# Altium schematic sheet nanoDAP-mini.SchDoc
size 340 x 398 mm
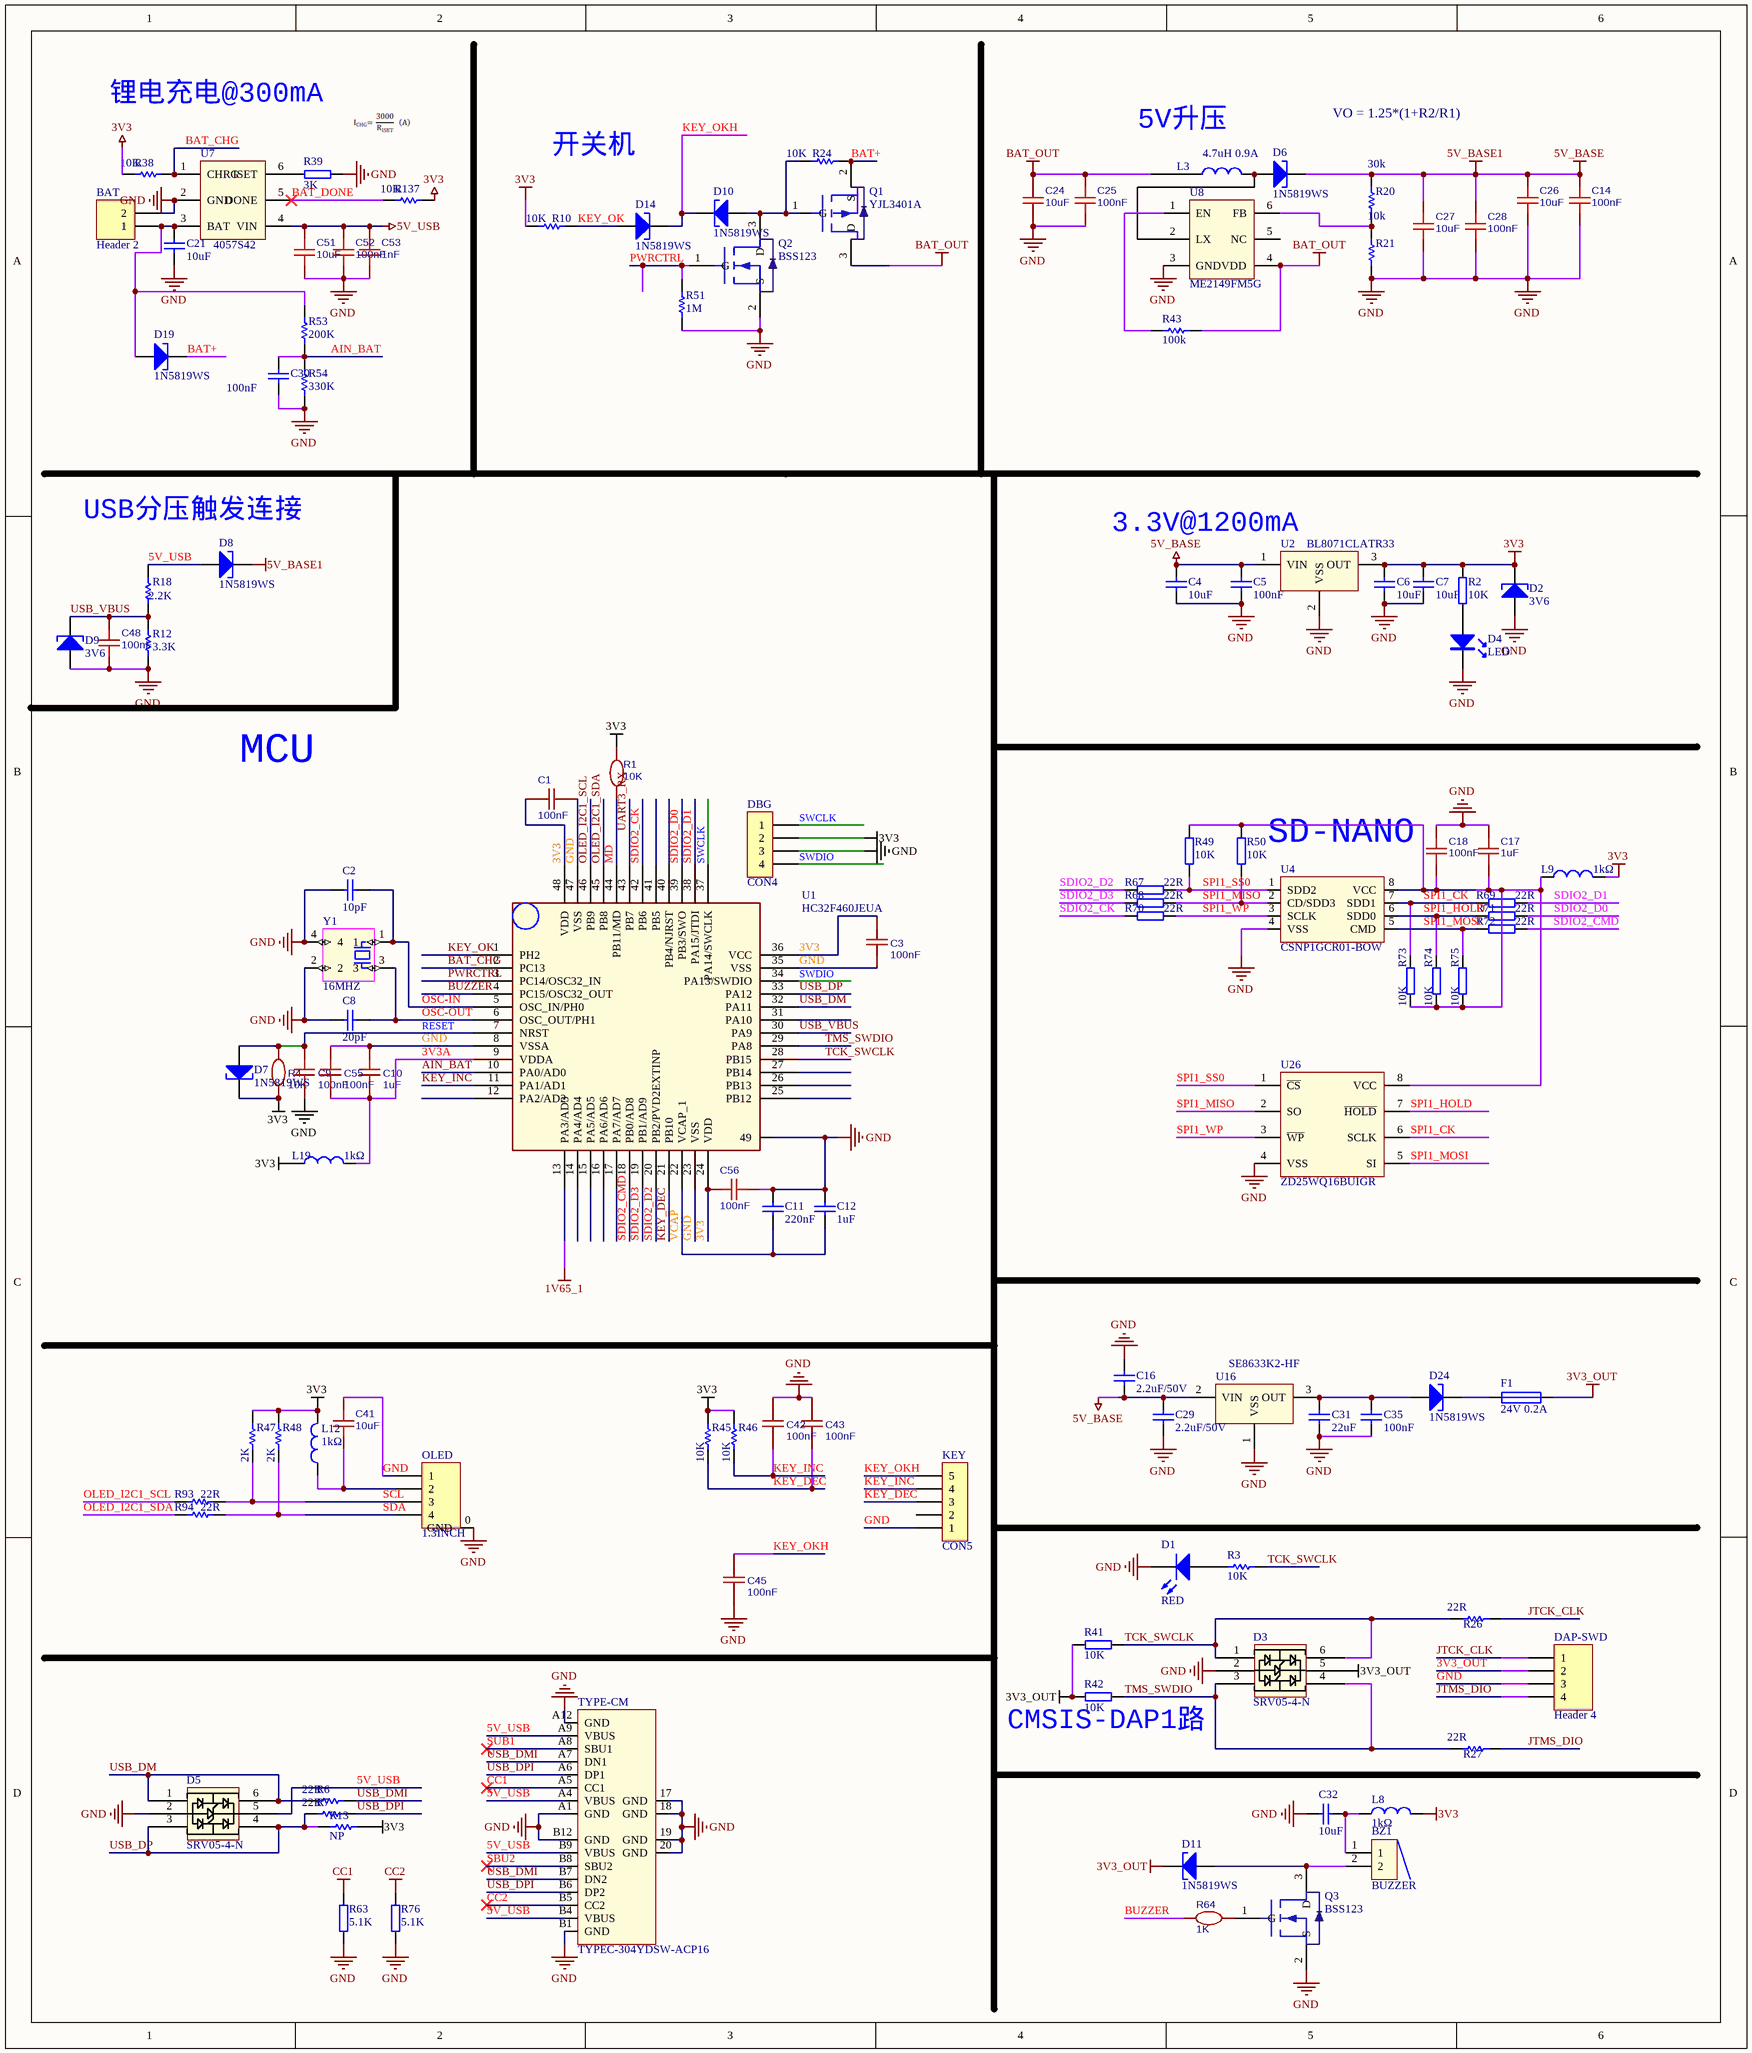
[diagram p0: nanoDAP-mini.SchDoc]

## Parts
BAT  Header 2  [XH2.54-2P]
BZ1  BUZZER  [BUZ-TH_BD9.0-P5.00-D0.6-FD]
C1  100nF  [C0603]
C2  10pF  [C0603]
C3  100nF  [C0603]
C4  10uF  [C0603]
C5  100nF  [C0603]
C6  10uF  [C0603]
C7  10uF  [C0603]
C8  20pF  [C0603]
C9  100nF  [C0603]
C10  1uF  [C0603]
C11  220nF  [C0603]
C12  1uF  [C0603]
C14  100nF  [C0603]
C16  2.2uF/50V  [C0805]
C17  1uF  [C0603]
C18  100nF  [C0603]
C21  10uF  [C0603]
C24  10uF  [C0603]
C25  100nF  [C0603]
C26  10uF  [C0603]
C27  10uF  [C0603]
C28  100nF  [C0603]
C29  2.2uF/50V  [C0805]
C30  100nF  [C0603]
C31  22uF  [C0805]
C32  10uF  [C0603]
C35  100nF  [C0805]
C41  10uF  [C0603]
C42  100nF  [C0603]
C43  100nF  [C0603]
C45  100nF  [C0603]
C48  100nF  [C0603]
C51  10uF  [C0603]
C52  100nF  [C0603]
C53  1nF  [C0603]
C55  100nF  [C0603]
C56  100nF  [C0603]
D1  RED  [0603_LED]
D2  3V6  [LL-34]
D3  SRV05-4-N  [SOT-23-6]
D4  LED  [0603_LED]
D5  SRV05-4-N  [SOT-23-6]
D6  1N5819WS  [SOD-323]
D7  1N5819WS  [SOD-323]
D8  1N5819WS  [SOD-323]
D9  3V6  [SOD-323]
D10  1N5819WS  [SOD-323]
D11  1N5819WS  [SOD-323]
D14  1N5819WS  [SOD-323]
D19  1N5819WS  [SOD-323]
D24  1N5819WS  [SOD-323]
DAP-SWD  Header 4  [XH2.54-4P]
DBG  CON4  [HDR1X4-SWD]
F1  24V 0.2A  [R0805]
KEY  CON5  [HDR1X5]
L3  4.7uH 0.9A  [IND_3x3]
L8  1kΩ  [L0603]
L9  1kΩ  [L0603]
L12  1kΩ  [L0603]
L19  1kΩ  [L0603]
OLED  1.3INCH  [OLED-4p-1.3inch-i2c]
Q1  YJL3401A  [SOT-23(SOT-23-3)]
Q2  BSS123  [SOT-23(SOT-23-3)]
Q3  BSS123  [SOT-23(SOT-23-3)]
R1  10K  [R0603]
R2  10K  [R0603]
R3  10K  [R0603]
R4  10K  [R0603]
R6  22R  [R0603]
R7  22R  [R0603]
R10  10K  [R0603]
R12  3.3K  [R0603]
R13  NP  [R0603]
R18  2.2K  [R0603]
R20  30k  [R0603]
R21  10k  [R0603]
R24  10K  [R0603]
R26  22R  [R0603]
R27  22R  [R0603]
R38  10K  [R0603]
R39  3K  [R0603]
R41  10K  [R0603]
R42  10K  [R0603]
R43  100k  [R0603]
R45  10K  [R0603]
R46  10K  [R0603]
R47  2K  [R0603]
R48  2K  [R0603]
R49  10K  [R0603]
R50  10K  [R0603]
R51  1M  [R0603]
R53  200K  [R0603]
R54  330K  [R0603]
R63  5.1K  [R0603]
R64  1K  [R0603]
R67  22R  [R0603]
R68  22R  [R0603]
R69  22R  [R0603]
R70  22R  [R0603]
R71  22R  [R0603]
R72  22R  [R0603]
R73  10K  [R0603]
R74  10K  [R0603]
R75  10K  [R0603]
R76  5.1K  [R0603]
R93  22R  [R0603]
R94  22R  [R0603]
R137  10K  [R0603]
TYPE-CM  TYPEC-304YDSW-ACP16  [USB-C-SMD_TYPEC-304YDSW-ACP16]
U1  HC32F460JEUA  [QFN-48_5X5X035P]
U2  BL8071CLATR33  [SOT-223]
U4  CSNP1GCR01-BOW  [LGA-8_L6.0-W8.0-P1.27-TL]
U7  4057S42  [SOT-23-6]
U8  ME2149FM5G  [SOT-23-6]
U16  SE8633K2-HF  [SOT-89&SOT-23]
U26  ZD25WQ16BUIGR  [USON-8_L3.0-W2.0-P0.50-BL-EP_ZD25XX]
Y1  16MHZ  [SMD-3225_4P]

## Nets
1V65_1: U1.13(PA3/AD3)
3V3: C1.2 C3.2 C6.1 C7.1 C56.2 D2.2(K) D7.2(K) DBG.2 L8.2 L9.2 L12.2 L19.1 R1.1 R2.1 R4.1 R10.1 R13.2 R38.2 R45.1 R46.1 R47.1 R48.1 R137.1 U1.24(VDD) U1.36(VCC) U1.48(VDD) U2.3(OUT)
3V3_OUT: D3.5 D11.2(K) DAP-SWD.2 F1.2 R41.1 R42.1
5V_BASE: C4.1 C5.1 C14.1 C16.1 C26.1 C27.1 C28.1 C29.1 D6.2(K) D8.2(K) R20.2 U2.1(VIN) U16.2(VIN)  [also labelled 5V_BASE1]
5V_USB: C51.1 C52.1 C53.1 D5.5 D8.1(A) R18.1 TYPE-CM.A4(VBUS) TYPE-CM.A9(VBUS) TYPE-CM.B4(VBUS) TYPE-CM.B9(VBUS) U7.4(VIN)
BAT_OUT: C24.1 C25.1 L3.1 Q1.3(D) R43.2 U8.4(VDD)
CC1: R63.2 TYPE-CM.A5(CC1)
CC2: R76.2 TYPE-CM.B5(CC2)
GND: BAT.2 C1.1 C2.1 C3.1 C4.2 C5.2 C6.2 C7.2 C8.2 C9.1 C10.2 C11.1 C12.1 C14.2 C16.2 C17.2 C18.2 C21.2 C24.2 C25.2 C26.2 C27.2 C28.2 C29.2 C30.2 C31.2 C32.1 C35.2 C41.1 C42.2 C43.2 C45.1 C48.1 C51.2 C52.2 C53.2 C55.2 C56.1 D1.2(K) D2.1(A) D3.2 D4.2 D5.2 D9.1(A) DAP-SWD.3 DBG.3 KEY.1 OLED.0(GND) OLED.1 Q2.2(S) Q3.2(S) R12.2 R21.2 R39.2 R51.2 R54.1 R63.1 R76.1 TYPE-CM.17(GND) TYPE-CM.18(GND) TYPE-CM.19(GND) TYPE-CM.20(GND) TYPE-CM.A1(GND) TYPE-CM.A12(GND) TYPE-CM.B1(GND) TYPE-CM.B12(GND) U1.8(VSSA) U1.23(VSS) U1.35(VSS) U1.47(VSS) U1.49 U2.2(VSS) U4.4(VSS) U7.2(GND) U8.3(GND) U16.1(VSS) U26.4(VSS) Y1.2 Y1.4
3V3A: C10.1 C55.1 L19.2 U1.9(VDDA)
AIN_BAT: C30.1 R53.2 R54.2 U1.10(PA0/AD0)
BAT+: D19.2(K) Q1.2(S) R24.1
BAT_CHG: R38.1 U1.2(PC13) U7.1(CHRG)
BAT_DONE: R137.2 U7.5(DONE)
BUZZER: R64.1 U1.4(PC15/OSC32_OUT)
JTCK_CLK: DAP-SWD.1 R26.2
JTMS_DIO: DAP-SWD.4 R27.2
KEY_DEC: C43.1 KEY.3 R45.2 U1.21(PB10)
KEY_INC: C42.1 KEY.4 R46.2 U1.11(PA1/AD1)
KEY_OK: D14.1(A) R10.2 U1.1(PH2)
KEY_OKH: C45.2 D10.2(K) D14.2(K) KEY.5
MD: R1.2 U1.44(PB11/MD)
OLED_I2C1_SCL: R93.1 U1.46(PB9)
OLED_I2C1_SDA: R94.1 U1.45(PB8)
OSC-IN: C2.2 U1.5(OSC_IN/PH0) Y1.1
OSC-OUT: C8.1 U1.6(OSC_OUT/PH1) Y1.3
PWRCTRL: Q2.1(G) R51.1 U1.3(PC14/OSC32_IN)
RESET: C9.2 D7.1(A) R4.2 U1.7(NRST)
SBU2: TYPE-CM.B8(SBU2)
SCL: OLED.3 R47.2 R93.2
SDA: OLED.4 R48.2 R94.2
SDIO2_CK: R70.2 U1.42(PB6)
SDIO2_CMD: R72.1 U1.18(PB0/AD8)
SDIO2_D0: R71.1 U1.39(PB3/SWO)
SDIO2_D1: R69.1 U1.38(PA15/JTDI)
SDIO2_D2: R67.2 U1.20(PB2/PVD2EXTINP)
SDIO2_D3: R68.2 U1.19(PB1/AD9)
SPI1_CK: R69.2 R73.1 U4.7(SDD1) U26.6(SCLK)
SPI1_HOLD: R71.2 R74.1 U4.6(SDD0) U26.7(~{HOLD})
SPI1_MISO: R50.1 R68.1 U4.2(CD/SDD3) U26.2(SO)
SPI1_MOSI: R72.2 R75.1 U4.5(CMD) U26.5(SI)
SPI1_SS0: R49.1 R67.1 U4.1(SDD2) U26.1(~{CS})
SPI1_WP: R70.1 U4.3(SCLK) U26.3(~{WP})
SUB1: TYPE-CM.A8(SBU1)
SWCLK: DBG.1 U1.37(PA14/SWCLK)
SWDIO: DBG.4 U1.34(PA13/SWDIO)
TCK_SWCLK: D3.1 D3.6 R3.2 R26.1 R41.2 U1.28(PB15)
TMS_SWDIO: D3.3 D3.4 R27.1 R42.2 U1.29(PA8)
UART3_RX: U1.43(PB7)
USB_DM: D5.1 D5.6 R6.1 U1.32(PA11)
USB_DMI: R6.2 TYPE-CM.A7(DN1) TYPE-CM.B7(DN2)
USB_DP: D5.3 D5.4 R7.1 R13.1 U1.33(PA12)
USB_DPI: R7.2 TYPE-CM.A6(DP1) TYPE-CM.B6(DP2)
USB_VBUS: C48.2 D9.2(K) R12.1 R18.2 U1.30(PA9)
VCAP: C11.2 C12.2 U1.22(VCAP_1)
NetBAT_1: BAT.1 C21.1 D19.1(A) R53.1 U7.3(BAT)
NetBZ1_1: BZ1.1 C32.2 L8.1
NetBZ1_2: BZ1.2 D11.1(A) Q3.3(D)
NetC17_1: C17.1 C18.1 L9.1 R49.2 R50.2 R73.2 R74.2 R75.2 U4.8(VCC) U26.8(VCC)
NetC31_1: C31.1 C35.1 D24.1(A) U16.3(OUT)
NetC41_2: C41.2 L12.1 OLED.2
NetD1_1: D1.1(A) R3.1
NetD4_1: D4.1 R2.2
NetD6_1: D6.1(A) L3.2 U8.2(LX)
NetD10_1: D10.1(A) Q1.1(G) Q2.3(D) R24.2
NetD24_2: D24.2(K) F1.1
NetQ3_1: Q3.1(G) R64.2
NetR20_1: R20.1 R21.1 U8.6(FB)
NetR39_1: R39.1 U7.6(ISET)
NetR43_1: R43.1 U8.1(EN)

Not connected (* = marked no-connect by the designer): KEY 2; U1 12(PA2/AD2) 14(PA4/AD4) 15(PA5/AD5) 16(PA6/AD6) 17(PA7/AD7) 25(PB12) 26(PB13) 27(PB14) 31(PA10) 40(PB4/NJRST) 41(PB5); U8 5(NC)

## Notes on the sheet
- 锂电充电@300mA
- VO = 1.25*(1+R2/R1)
- 开关机
- (near L3) 5V升压
- USB分压触发连接
- 3.3V@1200mA
- MCU
- SD-NANO
- (near R42) CMSIS-DAP1路

## Library data of the parts
BAT = Header 2: Header, 2-Pin; LatestRevisionDate: 17-Jul-2002; LatestRevisionNote: Re-released for DXP Platform.; Publisher: Altium Limited
C1 C3 C9 C10 C14 C17 C18 C24-C28 C41-C43 C45 C48 C51-C53 C55 C56 = 100nF: nameAlias: Value(F); spicePre: C; spiceSymbolName: Cap_RAD-0.1_US
C2 C8 C11 C12 = Cap: Capacitor; Value: 100pF; Published: 8-Jun-2000; LatestRevisionDate: 17-Jul-2002; LatestRevisionNote: Re-released for DXP Platform.; PackageReference: RAD-0.3; Publisher: Altium Limited; PackageDescription: Radial Cap, Thru-Hole; 2 Leads; 0.3 in Pin Spacing
C4-C7 C16 C21 C29-C32 C35 = Cap2: 电容
D1 = D0603: Typical RED, GREEN, YELLOW, AMBER GaAs LED; Published: 8-Jun-2000; LatestRevisionDate: 17-Jul-2002; LatestRevisionNote: Re-released for DXP Platform.; PackageVersion: Feb-2002; PackageReference: 3.2X1.6X1.1; Publisher: Altium Limited; PackageDescription: SM LED; 2 Flat Leads
D2 D6-D11 D14 D19 D24 = Diode Zener: 稳压二极管; Published: 8-Jun-2000; LatestRevisionDate: 17-Jul-2002; LatestRevisionNote: Re-released for DXP Platform.; PackageReference: DIODE-0.7; Publisher: Altium Limited; PackageDescription: Diode, Thru-Hole; 2 Leads; 0.7 in Pin Spacing
D3 D5 = ESD-USB
DAP-SWD OLED = Header 4: Header, 4-Pin; LatestRevisionDate: 17-Jul-2002; LatestRevisionNote: Re-released for DXP Platform.; Publisher: Altium Limited
DBG = CON4: 连接器
F1 = FUSE: 保险丝
KEY = CON5: 连接器
L3 L8 L9 L12 L19 = Inductor: 电感
Q1 = PMOS
Q2 Q3 = NMOS
R1 R4 R64 = 10K: nameAlias: Value(Ω); spicePre: R; spiceSymbolName: Res_AXIAL-0.3(1/8W)_EU
R2 R39 R41 R42 R49 R50 R63 R67-R76 = RES: 电阻
R3 R6 R7 R10 R12 R18 R20 R21 R24 R26 R27 R38 R43 R45 R46 R137 = R0603: Resistor; Published: 8-Jun-2000; LatestRevisionDate: 17-Jul-2002; LatestRevisionNote: Re-released for DXP Platform.; PackageReference: AXIAL-0.3; Publisher: Altium Limited; PackageDescription: Axial Device, Thru-Hole; 2 Leads; 0.3 in Pin Spacing
  R3 R10 R24 R38 R45 R46 R137: Value: 10K
  R6 R7 R26 R27: Value: 22R
R13 = R0603: Resistor; Value: 1K5; Published: 8-Jun-2000; LatestRevisionDate: 17-Jul-2002; LatestRevisionNote: Re-released for DXP Platform.; PackageReference: AXIAL-0.3; Publisher: Altium Limited; PackageDescription: Axial Device, Thru-Hole; 2 Leads; 0.3 in Pin Spacing
R47 R48 R93 R94 = R0603: Resistor; Value: 10K; Published: 8-Jun-2000; LatestRevisionDate: 17-Jul-2002; LatestRevisionNote: Re-released for DXP Platform.; PackageReference: AXIAL-0.3; Publisher: Altium Limited; PackageDescription: Axial Device, Thru-Hole; 2 Leads; 0.3 in Pin Spacing
R51 = R0603: Resistor; Value: 1K; Published: 8-Jun-2000; LatestRevisionDate: 17-Jul-2002; LatestRevisionNote: Re-released for DXP Platform.; PackageReference: AXIAL-0.3; Publisher: Altium Limited; PackageDescription: Axial Device, Thru-Hole; 2 Leads; 0.3 in Pin Spacing
R53 = R0603: Resistor; Value: 2K; Published: 8-Jun-2000; LatestRevisionDate: 17-Jul-2002; LatestRevisionNote: Re-released for DXP Platform.; PackageReference: AXIAL-0.3; Publisher: Altium Limited; PackageDescription: Axial Device, Thru-Hole; 2 Leads; 0.3 in Pin Spacing
R54 = R0603: Resistor; Value: 3.3K; Published: 8-Jun-2000; LatestRevisionDate: 17-Jul-2002; LatestRevisionNote: Re-released for DXP Platform.; PackageReference: AXIAL-0.3; Publisher: Altium Limited; PackageDescription: Axial Device, Thru-Hole; 2 Leads; 0.3 in Pin Spacing
TYPE-CM = USB-TYPE-C-母
U1 = LQFP48
U2 U16 = LDO
U4 = SD-NAND-SMD
U7 U8 = IC_6
U26 = IC_8
Y1 = crystal_smd_3225